# EAGLE design DIY BMSP Ver 3.1 (EAGLE 7.5.0)
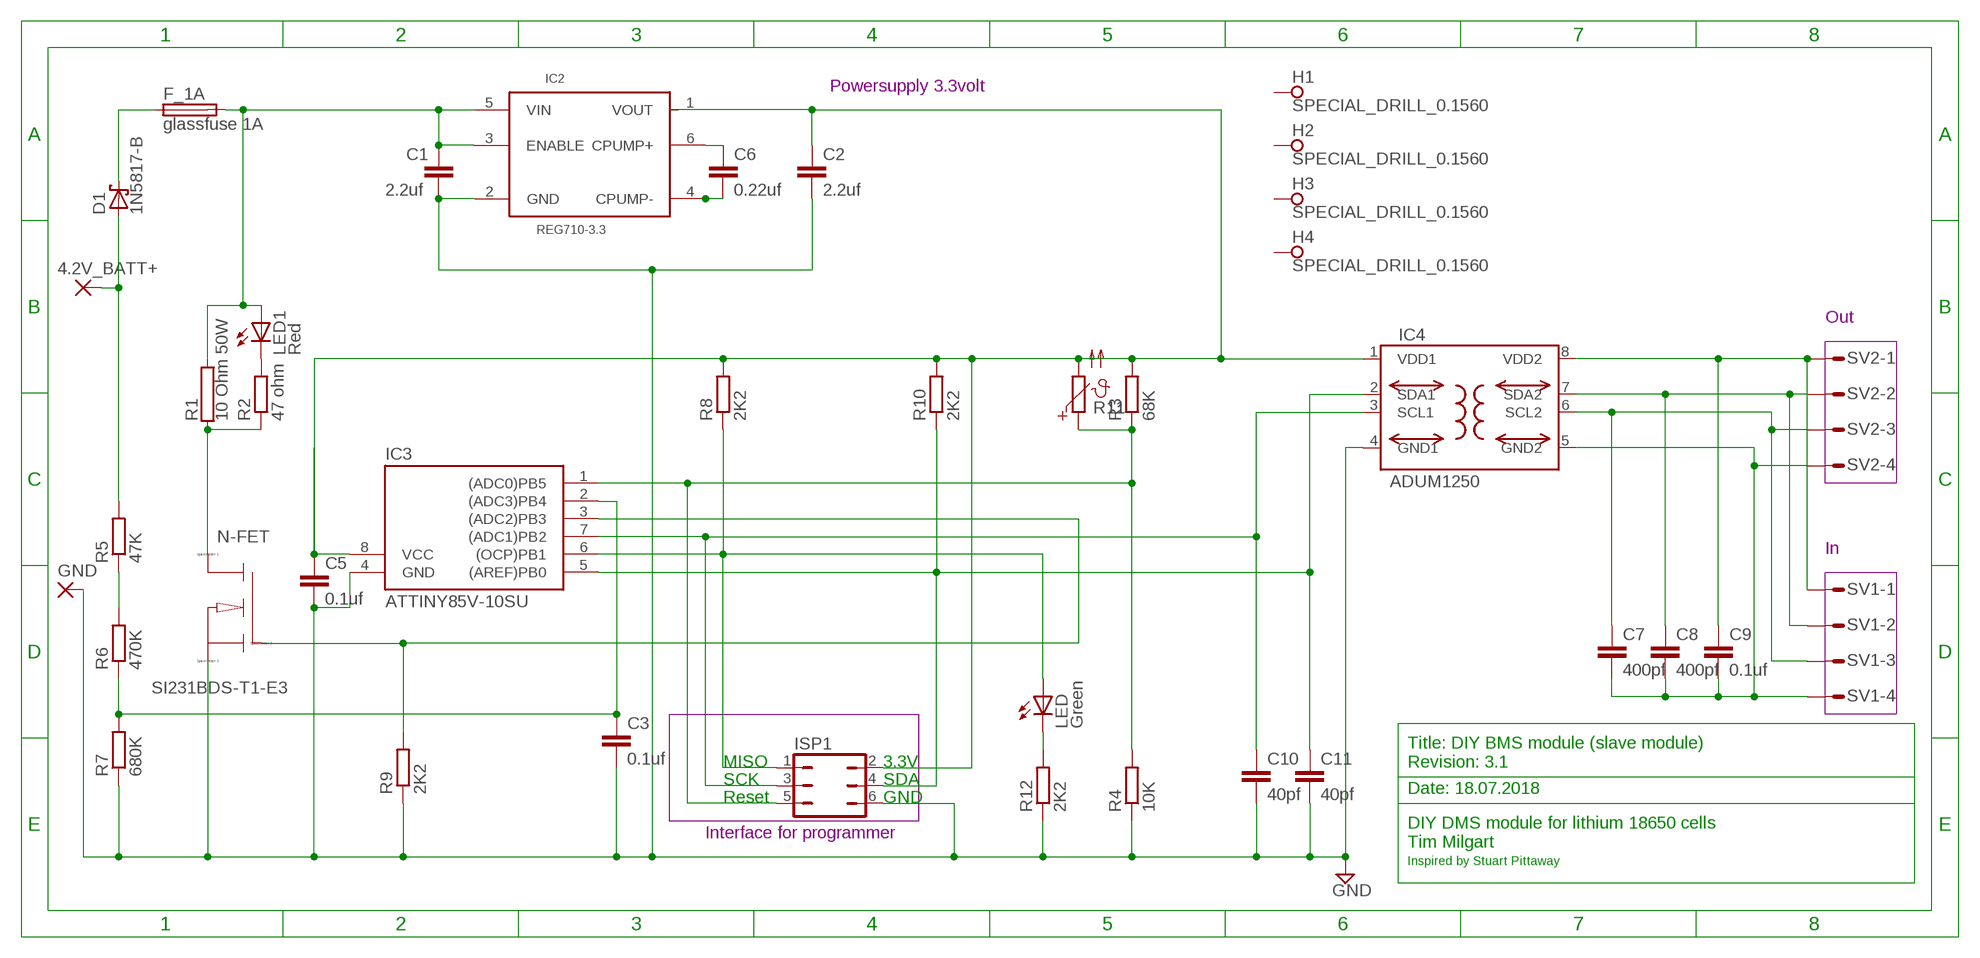
[diagram p0: schematic, sheet 1]

## Parts
4.2V_BATT+  3,17/1,3  [3,17/1,3]
C1  2.2uf  C-EU050-025X075  [C050-025X075]
C2  2.2uf  C-EU050-025X075  [C050-025X075]
C3  0.1uf  C-EU050-025X075  [C050-025X075]
C5  0.1uf  C-EU050-025X075  [C050-025X075]
C6  0.22uf  C-EU050-025X075  [C050-025X075]
C7  400pf  C-EU050-024X044  [C050-024X044]
C8  400pf  C-EU050-024X044  [C050-024X044]
C9  0.1uf  C-EU050-025X075  [C050-025X075]
C10  40pf  C-EU050-024X044  [C050-024X044]
C11  40pf  C-EU050-024X044  [C050-024X044]
D1  1N5817-B  [DO41-7.6]
F_1A  glassfuse 1A  FUSEPICOFUSE  [PICOFUSE]
GND  3,17/1,3  [3,17/1,3]
H1  SPECIAL_DRILL_0.1560  [PAD_0.1560]
H2  SPECIAL_DRILL_0.1560  [PAD_0.1560]
H3  SPECIAL_DRILL_0.1560  [PAD_0.1560]
H4  SPECIAL_DRILL_0.1560  [PAD_0.1560]
IC2  REG710-3.3  REG710NA(SOT23-6)  [SOT-23-6]
IC3  ATTINY85V-10SU  TINY15LP  [DIL08]
IC4  ADUM1250  [SO8-COOL]
ISP1  JP3Q  [JP3Q]
LED  Green  TLLG4400  [LED3MM]
LED1  Red  TLLG4400  [LED3MM]
N-FET  SI231BDS-T1-E3  NMOS  [SOT23]
R1  10 Ohm 50W  RHPS947  [HPS947]
R2  47 ohm  R-EU_0207/10  [0207/10]
R3  68K  R-EU_0207/10  [0207/10]
R4  10K  R-EU_0207/10  [0207/10]
R5  47K  R-EU_0207/10  [0207/10]
R6  470K  R-EU_0207/10  [0207/10]
R7  680K  R-EU_0207/10  [0207/10]
R8  2K2  R-EU_0207/10  [0207/10]
R9  2K2  R-EU_0207/10  [0207/10]
R10  2K2  R-EU_0207/10  [0207/10]
R11  PTC679  [P679]
R12  2K2  R-EU_0207/10  [0207/10]
SV1  L04P  [L04P]
SV2  L04P  [L04P]

## Nets
GND1: C1.2 C2.2 C3.2 C5.2 C10.2 C11.2 GND.1(P) IC3.4(GND) IC4.4(GND1) ISP1.6 N-FET.2(S) R4.1 R7.1 R9.1 R12.1 ; supply symbol labelled GND
GND2: C7.2 C8.2 C9.2 IC4.5(GND2) SV1.4 SV2.4
N$1: 4.2V_BATT+.1(P) D1.A R5.2
N$4: D1.C F_1A.1
N$5: C8.1 IC4.7(SDA2) SV1.2 SV2.2
N$6: C6.1 IC2.6(CPUMP+)
N$7: C7.1 IC4.6(SCL2) SV1.3 SV2.3
N$9: IC3.3((ADC2)PB3) N-FET.1(G) R9.2
N$10: LED.K(C) R12.2
N$11: C10.1 IC3.7((ADC1)PB2) IC4.3(SCL1) ISP1.3
N$12: C3.1 IC3.2((ADC3)PB4) R6.1 R7.2
N$13: C11.1 IC3.5((AREF)PB0) IC4.2(SDA1) ISP1.4 R10.1
N$14: R5.1 R6.2
N$15: C6.2 IC2.4(CPUMP-)
N$16: IC3.6((OCP)PB1) ISP1.1 LED.A R8.1
N$17: IC3.1((ADC0)PB5) ISP1.5 R3.1 R4.2 R11.1
N$47: N-FET.3(D) R1.1 R2.1
N$52: LED1.K(C) R2.2
N$53: C1.1 F_1A.2 IC2.3(ENABLE) IC2.5(VIN) LED1.A R1.2
VDD1: C2.1 C5.1 IC3.8(VCC) IC4.1(VDD1) ISP1.2 R3.2 R8.2 R10.2 R11.2
VDD2: C9.1 IC4.8(VDD2) SV1.1 SV2.1
Unconnected: H1.1 H2.1 H3.1 H4.1 IC2.1(VOUT)

## Notes on the sheet
- Powersupply 3.3volt
- Out
- In
- MISO | 3.3V
- Title: DIY BMS module (slave module)
  Revision: 3.1
- SCK | SDA
- Date: 18.07.2018
- Reset | GND
- Interface for programmer
- DIY DMS module for lithium 18650 cells
  Tim Milgart
- Inspired by Stuart Pittaway

## Power pins joined to a net without a drawn wire
GND1: IC2.2(GND)

## Library data of the parts
4.2V_BATT+ GND = wirepad:3,17/1,3: THROUGH-HOLE PAD
C1-C3 C5-C11 = rcl:C-EU: CAPACITOR, European symbol
D1 = diode:1N581*: 1.0A SCHOTTKY BARRIER RECTIFIER Source: http://www.diodes.com/datasheets/ds23001.pdf
F_1A = fuse:FUSE: Fuse; OC_FARNELL: unknown; OC_NEWARK: unknown
H1-H4 = special-drill:SPECIAL_DRILL_: Special drills
IC2 = Tim-ic2:REG710NA(SOT23-6): 3100302999; MPN: REG710NA
IC3 = atmel:TINY15L: MICROCONTROLLER 2.7 V 1 Kbytes FLASH 64 bytes EEPROM 4-channel 10 bit ADC; OC_FARNELL: unknown; OC_NEWARK: unknown
IC4 = analog-devices-3:ADUM1250: Hot Swappable, Dual I2C Isolators Source: http://www.analog.com/static/imported-files/data_sheets/ADUM1250_1251.pdf
ISP1 = jumper:JP3Q: JUMPER
LED LED1 = led:TLLG4400: Low Current (2mA) LED 3 mm Tinted Diffused Package color GREEN Source: Data sheet <http://www.farnell.com/datasheets/391098.pdf>; MF: VISHAY SEMICONDUCTOR; OC_FARNELL: 1612435
N-FET = sym:NMOS: N-Channel MOSFET transistor
R1 = resistor-power:R: Power Resitor; OC_FARNELL: unknown; OC_NEWARK: unknown
R2-R10 R12 = rcl:R-EU_: RESISTOR, European symbol
R11 = ptc-ntc:PTC679: PHILIPS PTC; OC_FARNELL: unknown; OC_NEWARK: unknown
SV1 SV2 = con-amp-mt:L04P: AMP MT CONNECTOR; OC_FARNELL: unknown; OC_NEWARK: unknown

## Board
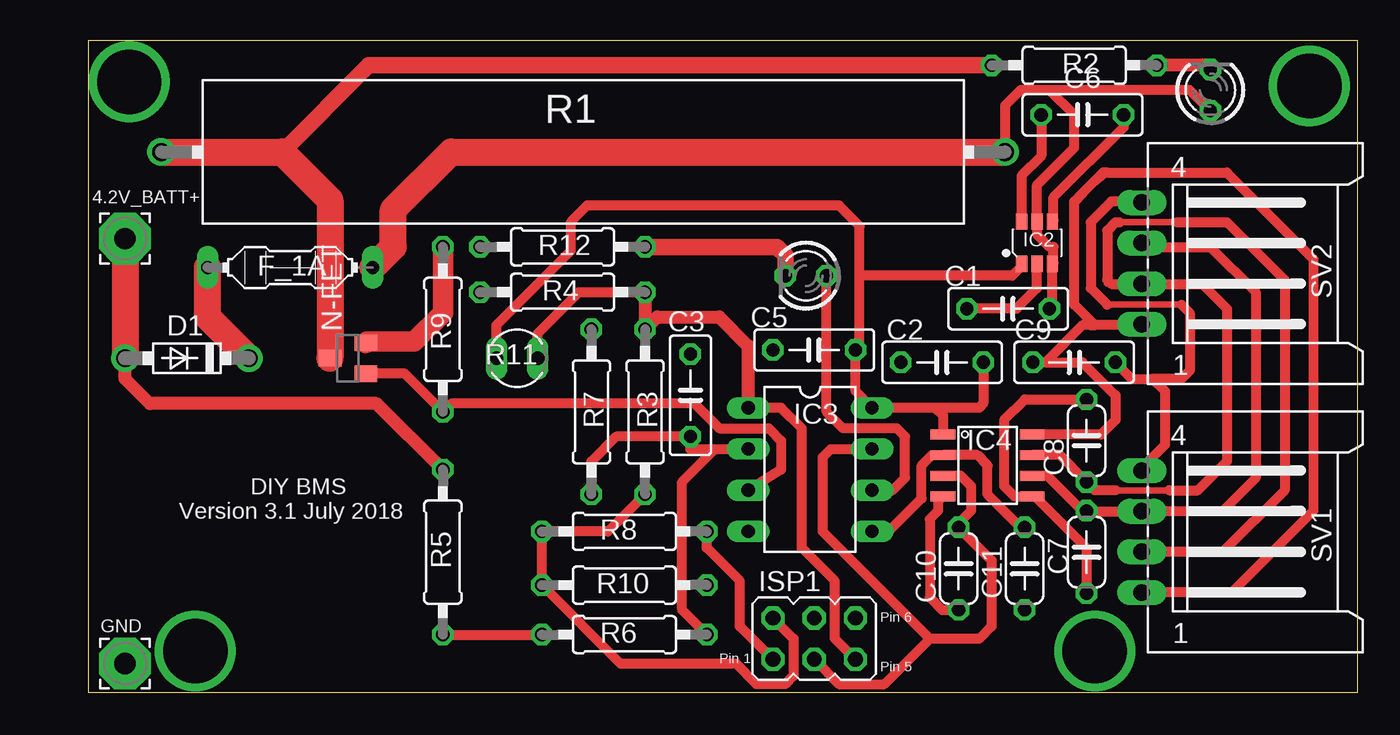
[diagram p1: board, top side]
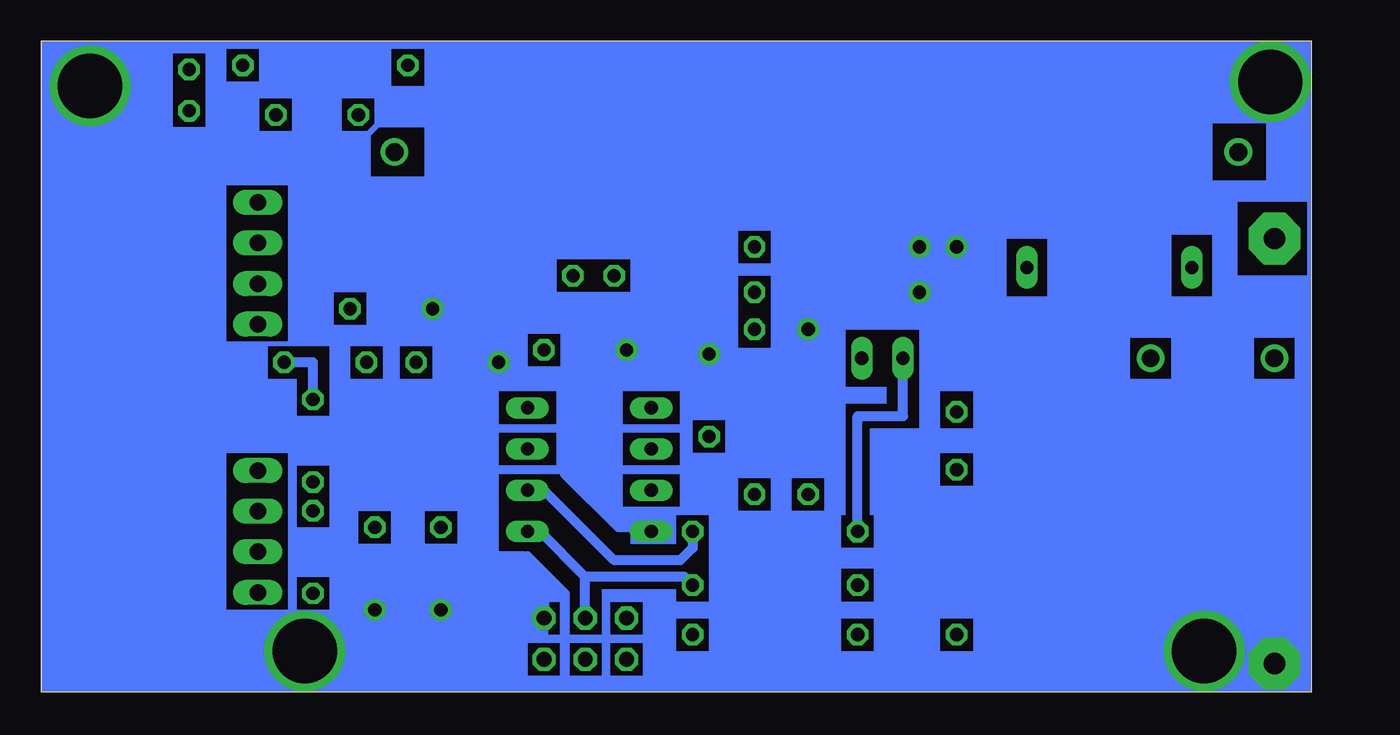
[diagram p2: board, bottom side, seen from below]

Size 78.16 x 40.12 mm. Coordinates in mm from the lower left corner, seen from the top.
Outline: 0,0 78.16,0 78.16,40.12 0,40.12 0,0
Copper layers (1*16): Top 0.035mm / dielectric 1.5mm / Bottom 0.035mm
Design rules "default": minimum track width 10mil, minimum drill 24mil, track to track 8mil, track to pad 8mil, pad to pad 8mil, via to via 8mil, smd to smd 8mil, copper to edge 40mil, drill to drill 8mil, minimum pad ring 10mil, minimum via ring 8mil, stop-mask expansion 4mil, vias tented up to drill 0mil, thermal gap 10mil

### Footprints (pad centres in the part's own frame; a part is rotated, then mirrored left to right if it is on the bottom)
3,17/1,3 = drill 1.321 pad 3.175 octagon: 1 0,0
C050-025X075 = drill 0.813 octagon: 1 -2.54,0; 2 2.54,0
C050-024X044 = drill 0.813 octagon: 1 -2.54,0; 2 2.54,0
DO41-7.6 = drill 1.1 pad 1.7: A 3.81,0; C -3.81,0
PICOFUSE = drill 0.813 long: 1 -5.08,0; 2 5.08,0
PAD_0.1560 = drill 3.962 pad 3.962: 1 0,0
SOT-23-6 = smd 0.69 x 1: 1 -0.95,-1.3; 2 0,-1.3; 3 0.95,-1.3; 4 0.95,1.3; 5 0,1.3; 6 -0.95,1.3
DIL08 = drill 0.813 long: 1 -3.81,-3.81; 2 -1.27,-3.81; 3 1.27,-3.81; 4 3.81,-3.81; 5 3.81,3.81; 6 1.27,3.81; 7 -1.27,3.81; 8 -3.81,3.81
SO8-COOL = smd 0.61 x 1.524: 1 -1.905,-2.743; 2 -0.635,-2.743; 3 0.635,-2.743; 4 1.905,-2.743; 5 1.905,2.743; 6 0.635,2.743; 7 -0.635,2.743; 8 -1.905,2.743
JP3Q = drill 0.914 octagon: 1 -2.54,-1.27; 2 -2.54,1.27; 3 0,-1.27; 4 0,1.27; 5 2.54,-1.27; 6 2.54,1.27
LED3MM = drill 0.813 octagon: A -1.27,0; K 1.27,0
SOT23 = smd 1 x 1.4: 1 -0.95,-1.1; 2 0.95,-1.1; 3 0,1.1
HPS947 = drill 1.1 pad 1.7: 1 -25.97,0; 2 25.97,0
0207/10 = drill 0.813 octagon: 1 -5.08,0; 2 5.08,0
P679 = drill 0.813 long: 1 -1.27,0; 2 1.27,0
L04P = drill 1.016 long: 1 3.75,-6.25; 2 1.25,-6.25; 3 -1.25,-6.25; 4 -3.75,-6.25

### Placement (x,y rotation side)
4.2V_BATT+  2.29,27.94 0 top
C1  56.64,23.62 180 top
C2  52.58,20.32 180 top
C3  37.08,18.29 90 top
C5  44.7,21.08 180 top
C6  61.21,35.56 0 top
C7  61.47,8.64 270 top
C8  61.47,15.49 90 top
C9  60.71,20.32 0 top
C10  53.59,7.62 270 top
C11  57.66,7.62 270 top
D1  6.1,20.57 180 top
F_1A  12.45,26.16 0 top
GND  2.29,1.78 0 top
H1  75.18,37.34 0 top
H2  61.98,2.54 0 top
H3  6.6,2.54 0 top
H4  2.54,37.59 0 top
IC2  58.42,27.69 0 top
IC3  44.45,13.72 270 top
IC4  55.37,13.97 270 top
ISP1  44.7,3.3 0 top
LED  44.2,25.65 180 top
LED1  69.09,37.08 90 top
N-FET  16,20.57 90 top
R1  30.48,33.27 0 top
R2  60.71,38.61 0 top
R3  34.29,17.27 270 top
R4  29.21,24.64 0 top
R5  21.84,8.64 90 top
R6  33.02,3.56 180 top
R7  30.99,17.27 270 top
R8  33.02,9.91 180 top
R9  21.84,22.35 270 top
R10  33.02,6.6 180 top
R11  26.42,20.57 180 top
R12  29.21,27.43 0 top
SV1  71.12,9.91 270 top
SV2  71.12,26.42 270 top

### Tracks (layer width: path | path; a pad name or v marks a point on that pad's centre or on a via)
GND1
  Top 0.61: IC2.2 58.42,24.89 57.15,23.62 C1.2 | IC4.4 52.32,11.76 52.32,11.18 51.82,10.67 51.82,5.84 52.58,5.08 C10.2
  Top 1.27: N-FET.2 17.17,21.59 20.07,21.59 21.84,23.37 R9.1
  Bottom 0.61: 47.24,6.35 47.24,7.11 48.51,8.38 | 47.24,6.1 47.24,4.83 | 47.24,4.83 ISP1.6 | ISP1.6 47.75,5.08 47.75,7.11 48.51,7.87 48.51,5.08 48.26,5.08 48.01,5.33 48.01,7.11 | 47.24,4.83 49.02,3.05 | ISP1.6 49.28,2.54 | 48.51,8.38 48.26,8.38 45.97,6.1 45.97,0.76 | 46.23,6.1 47.24,6.1 | 47.24,6.1 47.24,6.35 | 47.24,6.35 46.74,6.35 | C5.2 41.91,20.83 C3.2 | C1.2 C2.2 50.55,20.32 50.55,20.07 50.8,20.07 50.8,8.38 48.51,8.38 | ISP1.6 48.51,5.84 54.86,5.84 54.61,5.59 54.61,5.08 | IC3.4 40.89,10.16 42.67,10.16 45.97,13.46 45.97,19.3 45.97,19.56 | C10.2 54.61,5.08 | 54.61,5.08 C11.2
  Bottom 0.813: C3.2 30.99,20.83 R7.1 30.99,24.89 R4.1 | 21.84,6.86 23.37,8.38 23.37,24.13
  Bottom 1.016: R4.1 23.37,24.13 | GND.1 2.29,6.86 21.84,6.86 | C5.2 42.16,19.56 | 42.16,19.56 50.04,19.56 C2.2 | 42.16,19.56 42.16,19.3 45.97,19.3
  Bottom 1.27: R12.1 R4.1 R9.1
GND2
  Top 0.406: 62.74,23.88 67.31,23.88
  Top 0.61: C9.2 64.26,19.3 65.53,19.3 | 65.53,19.3 66.29,18.54 66.29,15.24 64.87,13.82 SV1.4 | C7.2 61.47,8.89 58.29,12.07 IC4.5 57.02,12.07 56.39,12.7 56.39,16.76 57.66,18.03 C8.2 | SV2.4 64.81,30.23 62.99,30.23 61.72,28.96 61.72,24.89 62.74,23.88 | 67.31,23.88 67.82,23.37 67.82,19.81 67.31,19.3 65.53,19.3
  Bottom 0.61: C8.2 61.47,20.32 C9.2
N$1
  Top 0.813: R5.2 17.78,17.78 3.81,17.78 2.29,19.3 D1.A
  Top 1.676: 4.2V_BATT+.1 D1.A
N$2
  Bottom 0.406: 57.4,35.05 58.42,34.04
N$4
  Top 1.676: D1.C 7.37,23.11 F_1A.1
N$5
  Top 0.406: 67.06,28.96 63.5,28.96 62.74,28.45 | 62.74,25.4 62.72,25.17 SV2.2 | 63.25,12.45 66.55,12.45
  Top 0.61: SV2.2 64.89,25.15 68.58,25.15 70.1,23.62 70.1,14.22 68.33,12.45 66.55,12.45 | 64.77,25.15 62.99,25.15 62.74,25.4 62.74,28.45 63.25,28.96 63.5,28.96 | 67.06,28.96 70.1,28.96 73.66,25.4 73.66,12.45 69.87,8.66 SV1.2 | IC4.7 59.82,14.61 C8.1 61.98,12.45 63.25,12.45
N$6
  Top 0.61: C6.1 58.67,33.02 57.47,31.82 IC2.6
N$7
  Top 0.61: SV2.3 65.1,27.43 69.09,27.43 71.88,24.64 71.88,13.21 69.83,11.16 SV1.3 61.49,11.16 C7.1 61.21,11.18 59.06,13.34 IC4.6
N$9
  Top 0.61: 40.89,12.7 IC3.3 42.67,13.72 42.67,15.49 41.91,16.26 38.86,16.26 37.34,17.78 22.35,17.78 R9.2 19.49,19.62 N-FET.1
N$10
  Top 1.016: R12.2 42.42,27.43 42.93,26.92 LED.K
N$11
  Top 0.61: IC3.7 45.72,14.99 45.21,14.48 45.21,9.91 51.69,3.43 | IC4.3 53.72,13.34 54.36,12.7 54.36,11.18 53.59,10.41 C10.1 55.63,8.13 55.63,4.06 54.86,3.3 51.82,3.3 51.69,3.43 | ISP1.3 46.23,0.51 49.02,0.51 51.69,3.17 51.69,3.43
N$12
  Top 0.61: 38.61,14.99 37.08,14.99 C3.1 32.51,15.75 30.99,14.22 R7.2 | 38.61,14.99 IC3.2 | R6.1 36.58,5.08 36.58,12.95 38.61,14.99
N$13
  Top 0.61: C11.1 57.4,10.16 55.37,12.19 55.37,13.97 54.74,14.61 IC4.2 51.94,14.61 51.31,13.97 51.31,11.94 49.28,9.91 IC3.5
  Bottom 0.61: R10.1 38.61,7.11 44.7,7.11 | 44.7,7.11 47.5,9.91 IC3.5 | ISP1.4 44.7,7.11
N$14
  Top 0.61: R5.1 R6.2
N$15
  Top 0.61: IC2.4 59.44,29.05 59.44,30.48 63.75,34.8 C6.2
N$16
  Top 0.61: IC3.6 49.53,12.45 50.29,13.21 50.29,15.75 49.78,16.26 46.48,16.26 45.47,17.27 LED.A | R8.1 38.1,8.89 40.13,6.86 40.13,4.06 ISP1.1
  Bottom 0.61: R8.1 38.1,8.89 38.86,8.13 42.93,8.13 47.24,12.45 IC3.6
N$17
  Top 0.61: ISP1.5 45.97,3.3 45.97,6.86 43.94,8.89 43.94,16.26 42.67,17.53 IC3.1 | R11.1 27.69,22.1 30.23,24.64 R4.2
  Top 0.813: R4.2 R3.1 35.05,23.11 38.86,23.11 40.64,21.34 IC3.1
N$47
  Top 1.016: 11.94,33.27 17.27,38.61 R2.1
  Top 1.676: R1.1 11.94,33.27 14.9,30.31 N-FET.3
N$52
  Top 0.813: LED1.K 68.83,38.61 R2.2
N$53
  Top 0.61: C1.1 59.37,23.81 IC2.3 59.44,26.45 59.44,27.43 59.18,27.43 58.42,28.19 IC2.5 58.42,31.24 60.71,33.53 60.71,35.56 59.18,37.08 | LED1.A 67.82,37.08 59.18,37.08 | 59.18,37.08 57.4,37.08 56.45,36.13 R1.2
  Top 1.676: F_1A.2 18.8,27.43 18.8,29.72 22.35,33.27 R1.2
VDD1
  Top 0.61: R3.2 32,9.91 R8.2 R10.2 32.77,1.78 39.88,1.78 41.15,0.51 42.93,0.51 43.43,1.02 43.43,3.3 ISP1.2 | IC4.1 52.63,17.07 52.17,17.53 | 52.17,17.53 IC3.8 47.24,18.54 C5.1 47.5,21.34 47.5,25.65 | 47.5,25.65 47.5,28.7 46.23,29.97 30.73,29.97 29.72,28.96 29.72,27.18 25.15,22.61 R11.2 | 57.4,26.16 56.9,25.65 47.5,25.65 | C2.1 55.12,17.78 54.86,17.53 52.17,17.53
  Bottom 0.61: IC3.8 49.28,17.53 | R8.2 27.94,17.02 25.15,17.02 R11.2
VDD2
  Top 0.406: 62.74,32 61.21,30.73 | SV2.1 63.69,22.67 63.63,22.61 61.98,22.61
  Top 0.61: SV2.1 64.93,22.61 | 64.93,22.61 64.97,22.56 65.02,22.61 64.93,22.61 | 64.93,22.61 61.98,22.61 | 61.72,22.86 61.72,22.61 | 61.72,22.61 61.98,22.61 | SV1.1 70.42,6.16 75.44,11.18 75.44,26.67 70.1,32 62.74,32 62.48,32 61.21,30.73 60.71,30.23 60.71,23.88 61.98,22.61 | IC4.8 62.36,15.88 63.25,16.76 63.25,18.29 61.21,20.32 58.93,20.32 | 61.72,22.61 61.21,22.61 58.93,20.32 | 58.93,20.32 C9.1
(copper drawn outside any net)
  shapes: Bottom area x150

### Text on the board
Bottom: Made by Tim Milgart 18/7-2018
tPlace: DIY BMS / Version 3.1 July 2018 | Pin 6 | Pin 1 | Pin 5